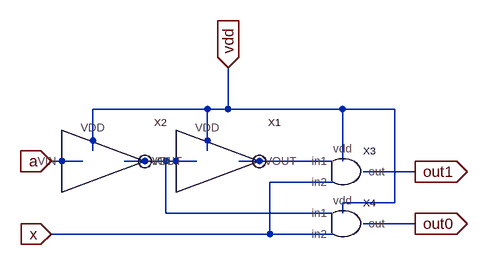
[diagram p0: schematic demux2.asc]
demux2.asc, the LTspice schematic file:
Version 4
SHEET 1 880 680
WIRE 64 32 -112 32
WIRE 96 32 96 -32
WIRE 96 32 64 32
WIRE 272 32 96 32
WIRE 352 32 272 32
WIRE -112 96 -112 32
WIRE 64 96 64 32
WIRE -128 112 -176 112
WIRE 0 112 -64 112
WIRE 48 112 0 112
WIRE 256 112 112 112
WIRE 272 112 272 32
WIRE 384 128 304 128
WIRE 256 144 160 144
WIRE 352 176 352 32
WIRE 352 176 272 176
WIRE 0 192 0 112
WIRE 256 192 0 192
WIRE 272 192 272 176
WIRE 384 208 304 208
WIRE 160 224 160 144
WIRE 160 224 -176 224
WIRE 256 224 160 224
FLAG 384 128 out1
IOPIN 384 128 Out
FLAG 384 208 out0
IOPIN 384 208 Out
FLAG -176 224 x
IOPIN -176 224 In
FLAG -176 112 a
IOPIN -176 112 In
FLAG 96 -32 vdd
IOPIN 96 -32 In
SYMBOL inverter 64 112 R0
SYMATTR InstName X1
SYMBOL inverter -112 112 R0
SYMATTR InstName X2
SYMBOL and 272 128 R0
SYMATTR InstName X3
SYMBOL and 272 208 R0
SYMATTR InstName X4

The netlist it stands for:
* demux2.asc
XX1 vdd N002 N001 inverter  ; pins VDD VOUT VIN
XX2 vdd N001 a inverter  ; pins VDD VOUT VIN
XX3 N002 x vdd out1 and  ; pins in1 in2 vdd out
XX4 N001 x vdd out0 and  ; pins in1 in2 vdd out
.backanno
.end